# EAGLE schematic attiny_x5_blink (EAGLE 9.1.3)
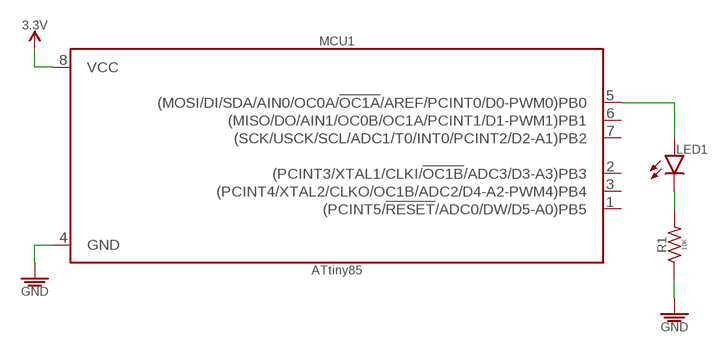
[diagram p0: schematic, sheet 1]

## Parts
LED1  LED_PTH_T-1_3/4_5MM_NO-COLOR  [LED_PTH_T-1_3/4_5MM]
MCU1  ATtiny85  ATTINY-X5_DIP-8_ATTINY-85  [DIP787W45P254L958H533Q8B_DIP-8_ATTINY-X5]
R1  10K  10KΩ_PTH-207/10_1/4W-5%  [RESAD990W55L630D240B]

## Nets
3.3V: MCU1.8(VCC)
GND: MCU1.4(GND) R1.1
N$1: LED1.A MCU1.5((MOSI/DI/SDA/AIN0/OC0A/!OC1A!/AREF/PCINT0/D0-PWM0)PB0)
N$2: LED1.K R1.2
Unconnected: MCU1.1((PCINT5/!RESET!/ADC0/DW/D5-A0)PB5) MCU1.2((PCINT3/XTAL1/CLKI/!OC1B!/ADC3/D3-A3)PB3) MCU1.3((PCINT4/XTAL2/CLKO/OC1B/ADC2/D4-A2-PWM4)PB4) MCU1.6((MISO/DO/AIN1/OC0B/OC1A/PCINT1/D1-PWM1)PB1) MCU1.7((SCK/USCK/SCL/ADC1/T0/INT0/PCINT2/D2-A1)PB2)

## Library data of the parts
LED1 = PiB_leds:LED
MCU1 = PiB_ic_microcontrollers:ATTINY-X5; DATASHEET: http://www.microchip.com/mymicrochip/filehandler.aspx?ddocname=en589893; DIST: Digikey; DISTLINK: https://www.digikey.com/products/en?keywords=ATTINY85-20PU-ND; DISTPN: ATTINY85-20PU-ND; MFR: Microchip Technology; MPN: ATTINY85-20PU; SPICEPREFIX: X
R1 = PiB_resistors:10KΩ; DATASHEET: http://www.yageo.com/NewPortal/yageodocoutput?fileName=/pdf/throughhole/Yageo_LR_CFR_2013.pdf; DIST: Digikey; DISTLINK: https://www.digikey.com/products/en?keywords=CFR-25JB-52-10K; DISTPN: 10KQBK-ND; MFR: Yageo; MPN: CFR-25JB-52-10K